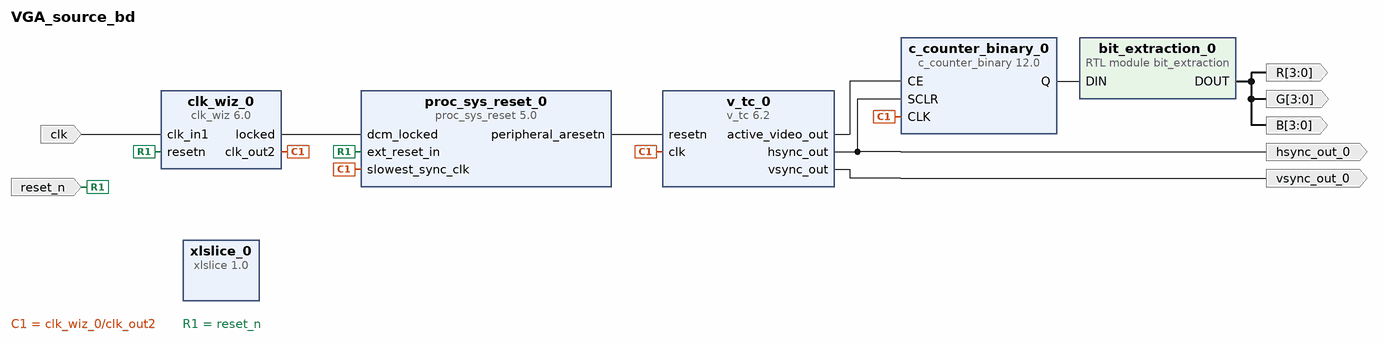
[diagram p0: block diagram of the top level]
# Vivado block design VGA_source_bd, xc7z020clg484-1, Vivado 2019.2
create_bd_design VGA_source_bd

create_bd_port -dir I -type rst reset_n
create_bd_port -dir I -type clk clk
create_bd_port -dir O hsync_out_0
create_bd_port -dir O vsync_out_0
create_bd_port -dir O -from 3 -to 0 R
create_bd_port -dir O -from 3 -to 0 B
create_bd_port -dir O -from 3 -to 0 G

create_bd_cell -type ip -vlnv xilinx.com:ip:clk_wiz:6.0 clk_wiz_0
set_property -dict [list \
  CONFIG.CLKOUT1_JITTER 114.767 \
  CONFIG.CLKOUT1_PHASE_ERROR 87.466 \
  CONFIG.CLKOUT1_REQUESTED_OUT_FREQ 108.00 \
  CONFIG.CLKOUT2_JITTER 155.403 \
  CONFIG.CLKOUT2_PHASE_ERROR 87.466 \
  CONFIG.CLKOUT2_REQUESTED_OUT_FREQ 25.200 \
  CONFIG.CLKOUT2_USED true \
  CONFIG.MMCM_CLKFBOUT_MULT_F 11.875 \
  CONFIG.MMCM_CLKOUT0_DIVIDE_F 11.000 \
  CONFIG.MMCM_CLKOUT1_DIVIDE 47 \
  CONFIG.MMCM_DIVCLK_DIVIDE 1 \
  CONFIG.NUM_OUT_CLKS 2 \
  CONFIG.RESET_PORT resetn \
  CONFIG.RESET_TYPE ACTIVE_LOW \
  CONFIG.USE_LOCKED true \
  CONFIG.USE_RESET true \
] [get_bd_cells clk_wiz_0]
create_bd_cell -type ip -vlnv xilinx.com:ip:c_counter_binary:12.0 c_counter_binary_0
set_property -dict {CONFIG.CE true CONFIG.Output_Width 8 CONFIG.SCLR true} [get_bd_cells c_counter_binary_0]
create_bd_cell -type ip -vlnv xilinx.com:ip:proc_sys_reset:5.0 proc_sys_reset_0
create_bd_cell -type ip -vlnv xilinx.com:ip:v_tc:6.2 v_tc_0
set_property -dict {CONFIG.HAS_AXI4_LITE false CONFIG.VIDEO_MODE 480p CONFIG.enable_detection false} [get_bd_cells v_tc_0]
create_bd_cell -type module -reference bit_extraction bit_extraction_0
create_bd_cell -type ip -vlnv xilinx.com:ip:xlslice:1.0 xlslice_0
set_property -dict {CONFIG.DIN_FROM 7 CONFIG.DIN_TO 4 CONFIG.DIN_WIDTH 8 CONFIG.DOUT_WIDTH 4} [get_bd_cells xlslice_0]

# ---- connections ----

connect_bd_net [get_bd_pins clk_wiz_0/clk_out2] \
  [get_bd_pins c_counter_binary_0/CLK] [get_bd_pins proc_sys_reset_0/slowest_sync_clk] [get_bd_pins v_tc_0/clk]
connect_bd_net [get_bd_pins clk_wiz_0/locked] [get_bd_pins proc_sys_reset_0/dcm_locked]
connect_bd_net [get_bd_ports reset_n] [get_bd_pins clk_wiz_0/resetn] [get_bd_pins proc_sys_reset_0/ext_reset_in]
connect_bd_net -net clk_in1_0_1 [get_bd_ports clk] [get_bd_pins clk_wiz_0/clk_in1]
connect_bd_net [get_bd_pins proc_sys_reset_0/peripheral_aresetn] [get_bd_pins v_tc_0/resetn]
connect_bd_net [get_bd_pins v_tc_0/hsync_out] [get_bd_ports hsync_out_0] [get_bd_pins c_counter_binary_0/SCLR]
connect_bd_net [get_bd_pins v_tc_0/vsync_out] [get_bd_ports vsync_out_0]
connect_bd_net [get_bd_pins v_tc_0/active_video_out] [get_bd_pins c_counter_binary_0/CE]
connect_bd_net [get_bd_pins c_counter_binary_0/Q] [get_bd_pins bit_extraction_0/DIN]
connect_bd_net [get_bd_pins bit_extraction_0/DOUT] [get_bd_ports R] [get_bd_ports G] [get_bd_ports B]

validate_bd_design
save_bd_design
